# EAGLE design Wheel Speed Sensor rev 1 (EAGLE 9.5.0)
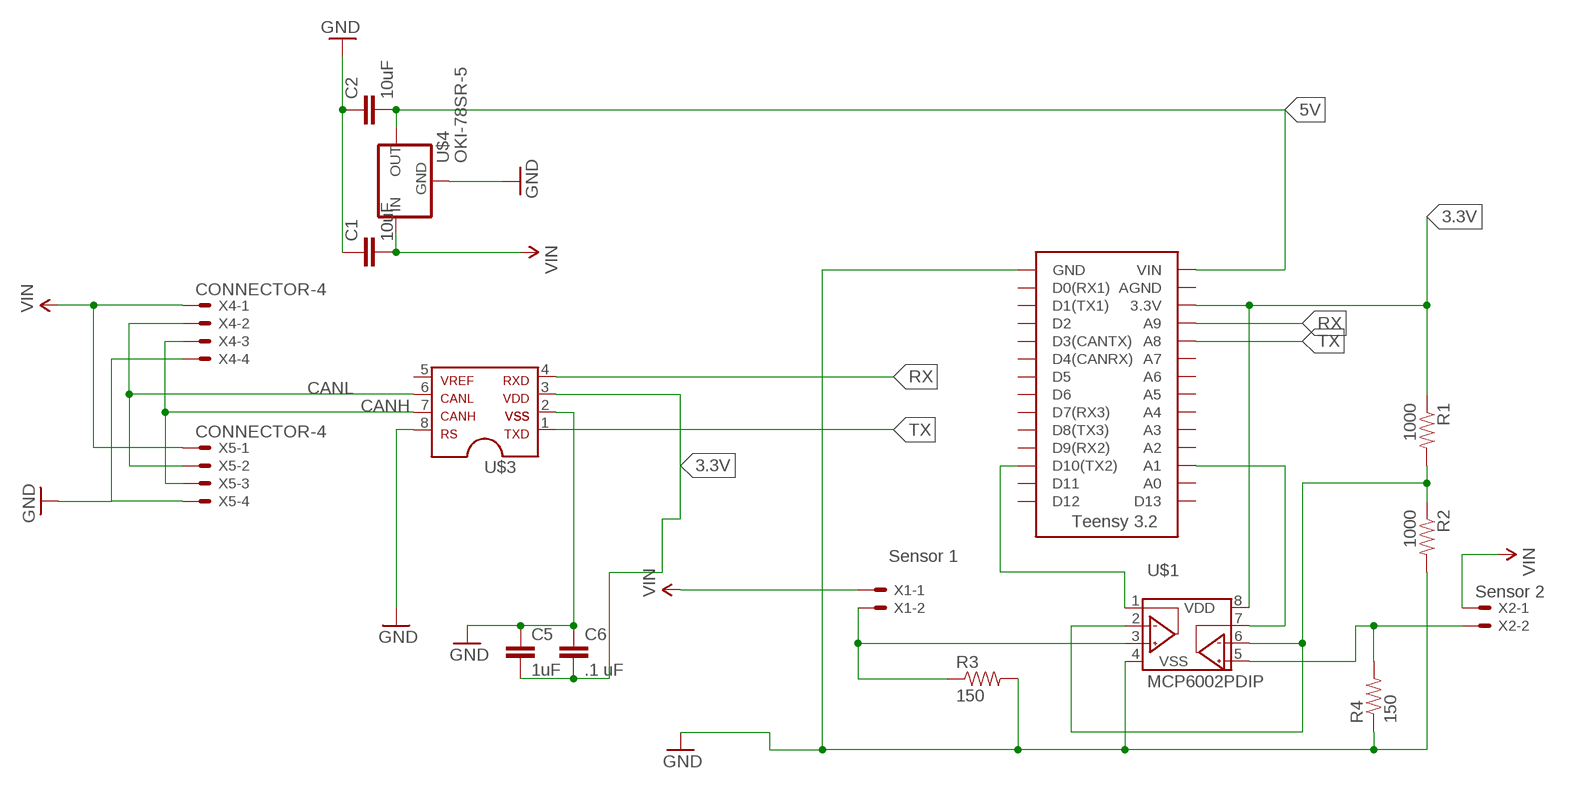
[diagram p0: schematic, sheet 1]

## Parts
C1  10uF  CAPPTH1  [CAP-PTH-5MM]
C2  10uF  CAPPTH1  [CAP-PTH-5MM]
C5  1uF  CAPPTH1  [CAP-PTH-5MM]
C6  .1 uF  CAPPTH1  [CAP-PTH-5MM]
R1  1000  RESISTORAXIAL-0.3  [AXIAL-0.3]
R2  1000  RESISTORAXIAL-0.3  [AXIAL-0.3]
R3  150  RESISTORAXIAL-0.3  [AXIAL-0.3]
R4  150  RESISTORAXIAL-0.3  [AXIAL-0.3]
U$1  MCP6002PDIP  [DIL08]
U$2  TEENSY_3.2_SIMPLE  [TEENSY_3.2_SIMPLE]
U$3  MCP2551  [SOIC-08]
U$4  OKI-78SR-5  [OKI-78SR]
X1  Sensor 1  CONNECTOR-2  [MINIFIT_5566-2]
X2  Sensor 2  CONNECTOR-2  [MINIFIT_5566-2]
X4  CONNECTOR-4  [MINIFIT_5566-4]
X5  CONNECTOR-4  [MINIFIT_5566-4]

## Nets
3.3V: C5.2 C6.2 R1.P$1 U$1.8(VDD) U$2.3.3V U$3.3
5V: C2.2 U$2.VIN U$4.3(OUT)
CANH: U$3.7 X4.3 X5.3
CANL: U$3.6 X4.2 X5.2
GND: C1.1 C2.1 C5.1 C6.1 R2.P$2 R3.P$2 R4.P$1 U$1.4(VSS) U$2.GND U$3.2 U$3.8 U$4.2(GND) X4.4 X5.4
N$2: R1.P$2 R2.P$1 U$1.2(VINA-) U$1.6(VINB-)
N$4: R3.P$1 U$1.3(VINA+) X1.2
N$5: U$1.7(VOUTB) U$2.A1
N$6: U$1.1(VOUTA) U$2.D10(TX2)
N$8: R4.P$2 U$1.5(VINB+) X2.2
RX: U$2.A9 U$3.4
TX: U$2.A8 U$3.1
VIN: C1.2 U$4.1(IN) X1.1 X2.1 X4.1 X5.1
Unconnected: U$2.A0 U$2.A2 U$2.A3 U$2.A4 U$2.A5 U$2.A6 U$2.A7 U$2.AGND U$2.D0(RX1) U$2.D1(TX1) U$2.D2 U$2.D3(CANTX) U$2.D4(CANRX) U$2.D5 U$2.D6 U$2.D7(RX3) U$2.D8(TX3) U$2.D9(RX2) U$2.D11 U$2.D12 U$2.D13 U$3.5

## Library data of the parts
C1 C2 C5 C6 = HyTechDevices:CAP: Capacitor Standard 0603 ceramic capacitor, and 0.1" leaded capacitor.
R1-R4 = HyTechDevices:RESISTOR: Resistor Basic schematic elements and footprints for 0603, 1206, and PTH resistors.
U$1 = HyTechDevices:MCP6002: Microchip MCP6002 Dual Channel Op Amp
U$2 = HyTechDevices:TEENSY_3.2_SIMPLE: Simple version of the Teensy 3.2 board that only uses the 2 main rows of pins, not the inner pins or the pins opposite the usb port.
U$3 = HyTechDevices:MCP2551: MCP2551 High-Speed CAN Transceiver Product Webpage <https://www.microchip.com/wwwproducts/en/MCP2551> Datasheet <http://ww1.microchip.com/downloads/en/DeviceDoc/21667f.pdf> This device is outdated It is replaced by MCP2561. Comparison Page <https://www.microchip.com/wwwproducts/ProductCompare/MCP2551/MCP2561> Product Webpage <https://www.microchip.com/wwwproducts/en/MCP2561> Datasheet <http://ww1.microchip.com/downloads/en/DeviceDoc/20005167C.pdf>
U$4 = HyTechDevices:OKI-78SR-5: Murata OKI-78SR 5V 1.5A Non-Isolated Switching Regulator DC/DC - Datasheet <https://power.murata.com/data/power/oki-78sr.pdf>
X1 X2 = HyTechDevices:CONNECTOR-2: Mini-Fit Junior connector 2 pole Source: http://www.molex.com; OC_FARNELL: 1822072; OC_NEWARK: unknown
X4 X5 = HyTechDevices:CONNECTOR-4: Mini-Fit Junior connector 4 pole Source: http://www.molex.com; OC_FARNELL: unknown; OC_NEWARK: unknown

## Board
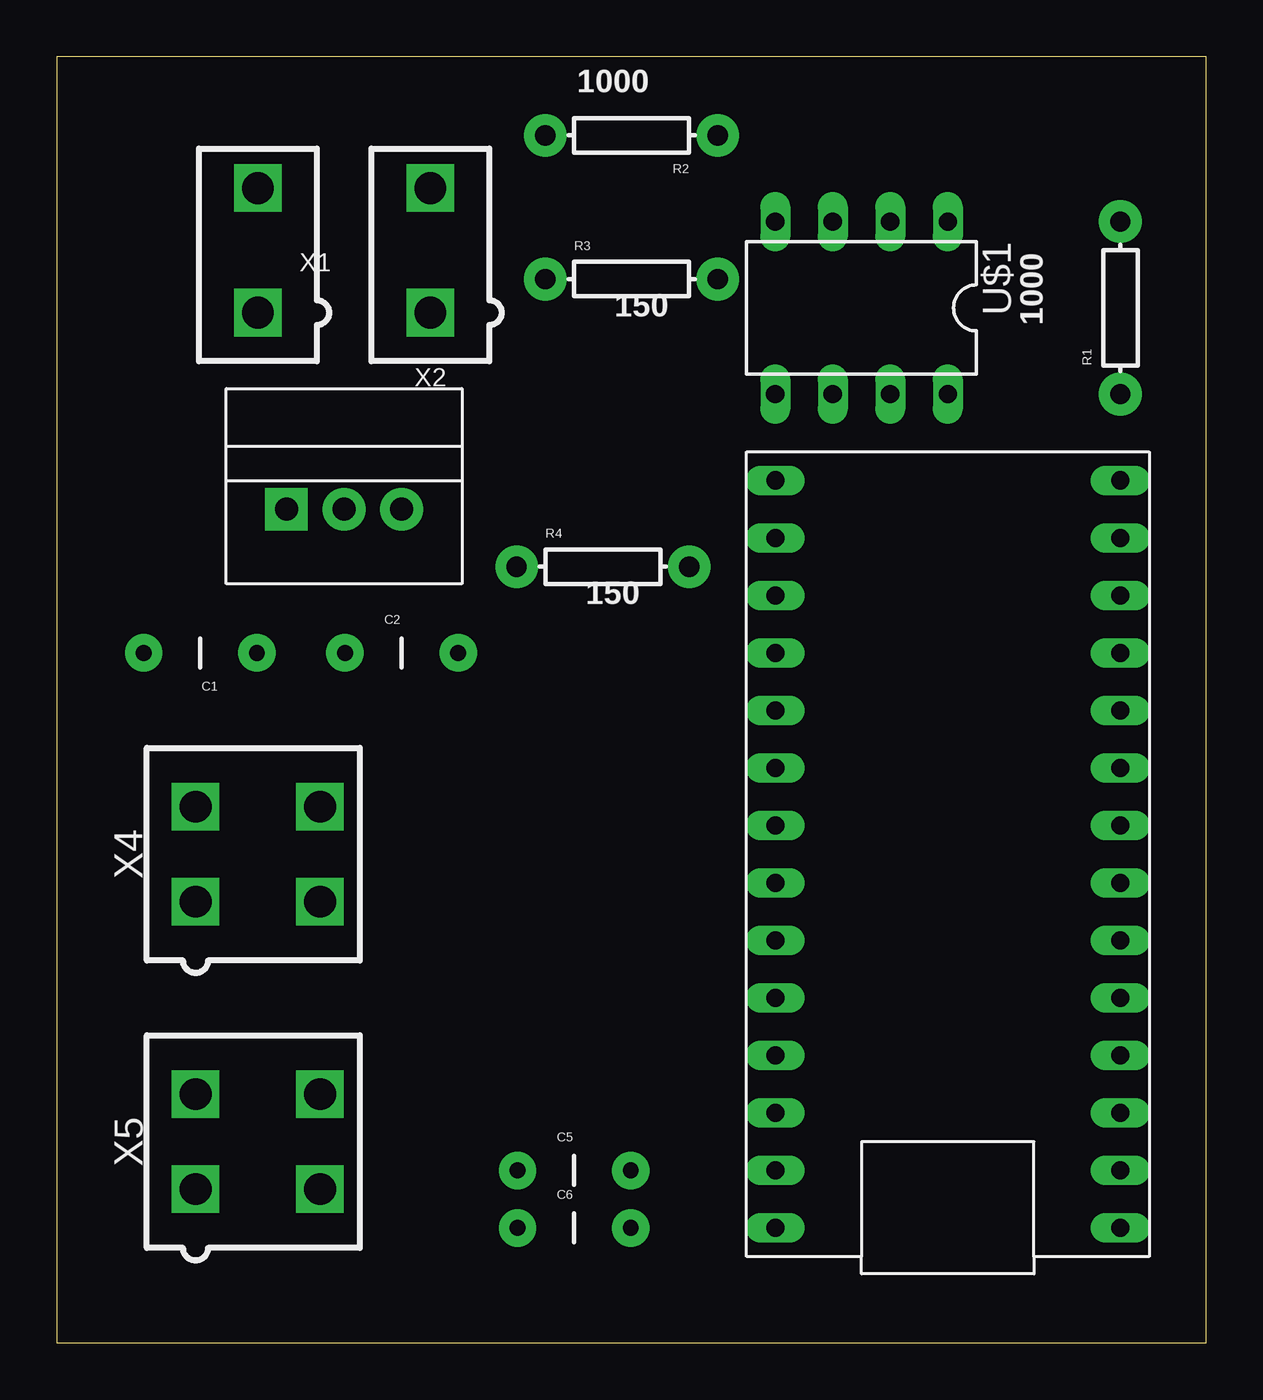
[diagram p1: board, top side]
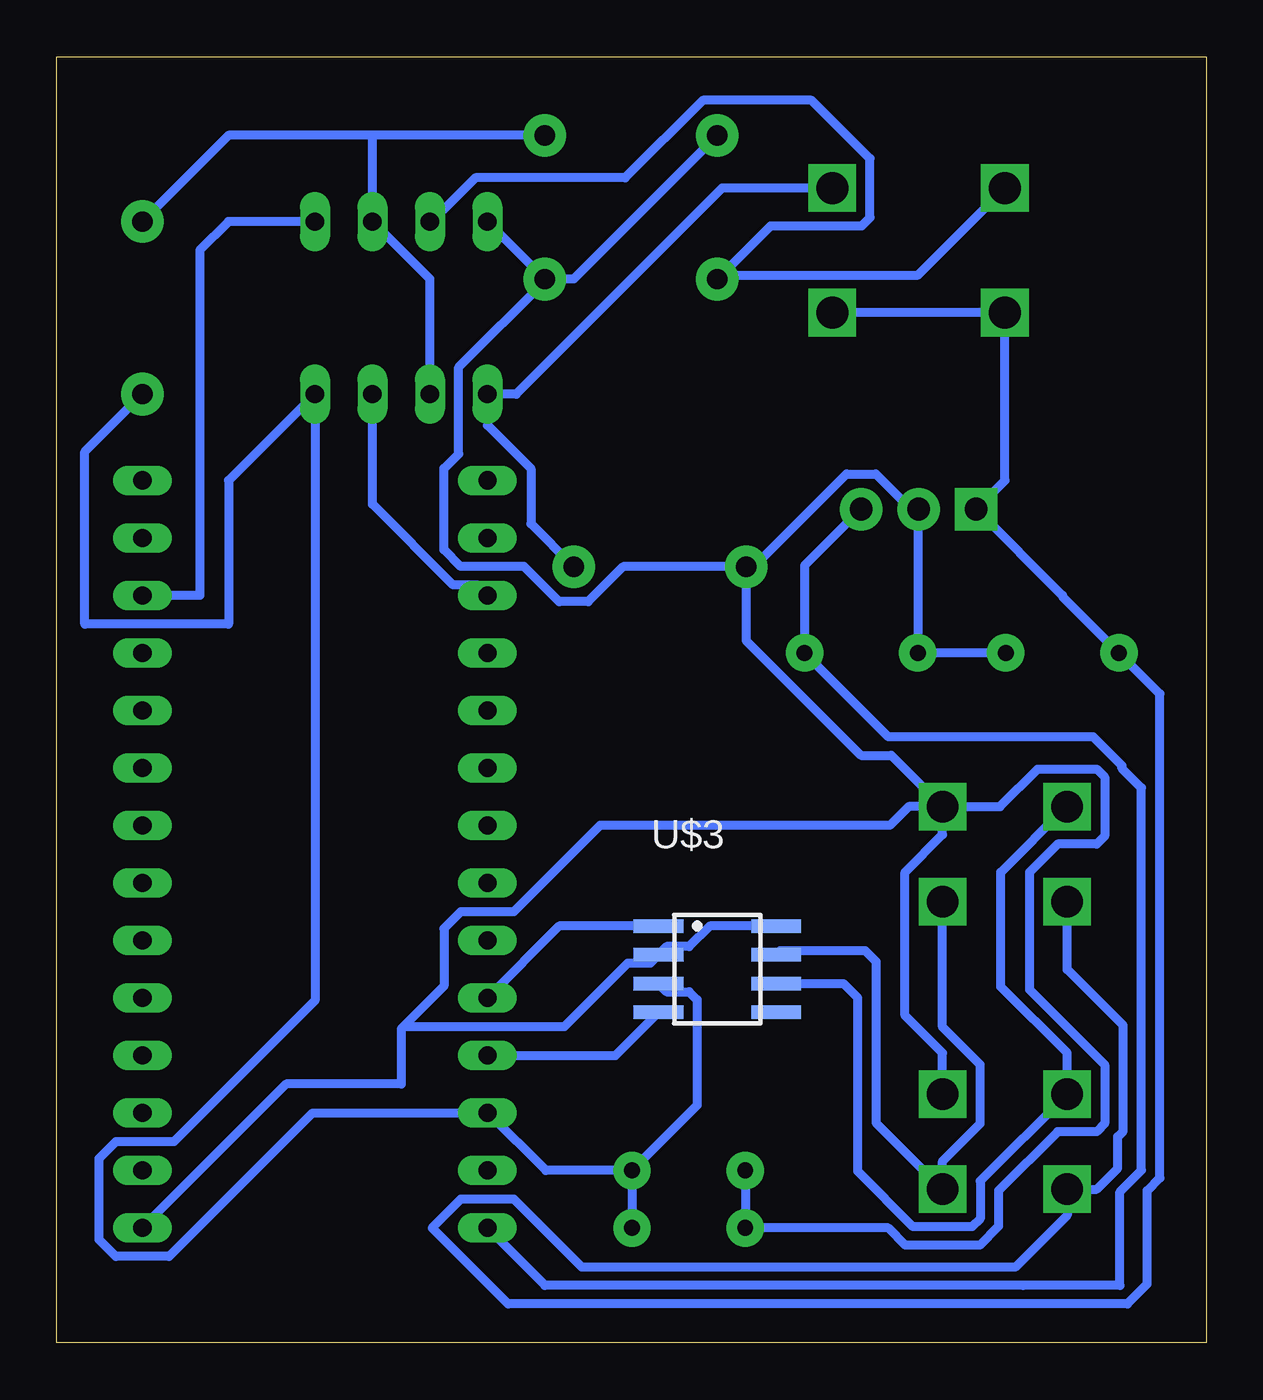
[diagram p2: board, bottom side, seen from below]

Size 50.78 x 56.82 mm. Coordinates in mm from the lower left corner, seen from the top.
Outline: 0,0 50.78,0 50.78,56.82 0,56.82 0,0
Copper layers (1*16): Top 0.035mm / dielectric 1.5mm / Bottom 0.035mm
Design rules "default *": minimum track width 16mil, minimum drill 0.35mm, track to track 16mil, track to pad 16mil, pad to pad 16mil, via to via 16mil, smd to smd 16mil, copper to edge 40mil, drill to drill 6mil, minimum pad ring 10mil, minimum via ring 8mil, stop-mask expansion 4mil, vias tented up to drill 0mil, thermal gap 10mil

### Footprints (pad centres in the part's own frame; a part is rotated, then mirrored left to right if it is on the bottom)
CAP-PTH-5MM = drill 0.7 pad 1.651: 1 -2.5,0; 2 2.5,0
AXIAL-0.3 = drill 0.9 pad 1.88: P$1 -3.81,0; P$2 3.81,0
DIL08 = drill 0.813 long: 1 -3.81,-3.81; 2 -1.27,-3.81; 3 1.27,-3.81; 4 3.81,-3.81; 5 3.81,3.81; 6 1.27,3.81; 7 -1.27,3.81; 8 -3.81,3.81
TEENSY_3.2_SIMPLE = drill 0.8 long: 3.3V 16.51,29.21; A0 16.51,3.81; A1 16.51,6.35; A2 16.51,8.89; A3 16.51,11.43; A4 16.51,13.97; A5 16.51,16.51; A6 16.51,19.05; A7 16.51,21.59; A8 16.51,24.13; A9 16.51,26.67; AGND 16.51,31.75; D0(RX1) 1.27,31.75; D1(TX1) 1.27,29.21; D2 1.27,26.67; D3(CANTX) 1.27,24.13; D4(CANRX) 1.27,21.59; D5 1.27,19.05; D6 1.27,16.51; D7(RX3) 1.27,13.97; D8(TX3) 1.27,11.43; D9(RX2) 1.27,8.89; D10(TX2) 1.27,6.35; D11 1.27,3.81; D12 1.27,1.27; D13 16.51,1.27; GND 1.27,34.29; VIN 16.51,34.29
SOIC-08 = smd 0.6 x 2.2: 1 -1.905,-2.6; 2 -0.635,-2.6; 3 0.635,-2.6; 4 1.905,-2.6; 5 1.905,2.6; 6 0.635,2.6; 7 -0.635,2.6; 8 -1.905,2.6
OKI-78SR = drill 1 pad 1.88 square: 1 -2.54,0 | drill 1 pad 1.88: 2 0,0; 3 2.54,0
MINIFIT_5566-2 = drill 1.4 square: 1 0,-2.75; 2 0,2.75
MINIFIT_5566-4 = drill 1.4 square: 1 2.1,-2.75; 2 -2.1,-2.75; 3 2.1,2.75; 4 -2.1,2.75

### Placement (x,y rotation side)
C1  6.35,30.48 180 top
C2  15.24,30.48 0 top
C5  22.86,7.62 0 top
C6  22.86,5.08 0 top
R1  46.99,45.72 90 top
R2  25.4,53.34 180 top
R3  25.4,46.99 0 top
R4  24.13,34.29 0 top
U$1  35.56,45.72 180 top
U$2  48.26,39.37 180 top
U$3  21.59,16.51 270 bottom
U$4  12.7,36.83 0 top
X1  8.89,48.26 0 top
X2  16.51,48.26 0 top
X4  8.89,21.59 270 top
X5  8.89,8.89 270 top

### Tracks (layer width: path | path; a pad name or v marks a point on that pad's centre or on a via)
3.3V
  Bottom 0.406: R1.P$1 49.53,39.37 49.53,31.75 43.18,31.75 43.18,38.1 U$1.8 39.37,15.12 45.61,8.88 48.17,8.88 48.91,8.14 48.91,4.56 48.17,3.82 45.81,3.82 39.47,10.16 U$2.3.3V 31.71,10.16 29.17,7.62 C5.2 | C5.2 C6.2 | U$3.3 23.83,15.52 22.84,15.52 22.48,15.16 22.48,10.5 C5.2
5V
  Bottom 0.406: U$4.3 17.74,34.33 C2.2 14.03,26.77 4.98,26.77 3.71,25.5 3.71,25.38 2.86,24.52 2.86,7.62 3.81,6.67 3.81,2.54 8.09,2.54 29.21,2.54 U$2.VIN
CANH
  Bottom 0.406: X4.3 11.64,13.95 9.98,12.29 9.98,9.69 11.64,8.03 X5.3 14.58,9.73 14.58,16.85 15.06,17.32 18.81,17.32 U$3.7
CANL
  Bottom 0.406: X4.2 6.17,23.69 9.07,20.79 9.07,15.73 6.14,12.8 X5.2 9.98,7.15 9.98,5.49 10.34,5.13 12.94,5.13 15.39,7.58 15.39,15.24 16.03,15.88 U$3.6
GND
  Bottom 0.406: R4.P$1 19.97,34.29 15.88,38.38 14.6,38.38 13.05,36.83 U$4.2 12.74,36.79 C2.1 C1.1 | R2.P$2 27.94,46.99 R3.P$2 | R3.P$2 29.21,46.91 33.02,43.1 33.02,39.27 33.67,38.62 33.67,35.04 32.93,34.3 30.14,34.3 28.58,32.74 27.3,32.74 25.75,34.29 R4.P$1 | U$1.4 R3.P$2 | U$2.GND 40.63,11.44 35.56,11.44 35.56,13.87 35.45,13.98 | X5.4 11.64,12.8 13.3,14.46 13.3,20.79 11.64,22.45 X4.4 | C5.1 C6.1 14.04,5.08 13.28,4.32 10,4.32 9.17,5.15 9.17,6.73 6.56,9.33 4.84,9.33 4.48,9.69 4.48,12.29 7.8,15.61 7.8,20.79 6.56,22.03 4.84,22.03 4.48,22.39 4.48,24.99 4.84,25.35 7.44,25.35 9.1,23.69 X4.4 | 35.45,13.98 33.67,15.76 33.67,18.3 32.93,19.04 30.59,19.04 26.77,22.86 13.97,22.86 13.14,23.69 X4.4 | 35.45,13.98 28.35,13.98 25.54,16.79 24.55,16.79 U$3.2 23.83,17.51 22.84,17.51 21.93,18.41 U$3.8 | X4.4 13.9,25.95 15.24,25.95 20.32,31.03 R4.P$1
N$2
  Bottom 0.406: R2.P$1 36.83,53.34 | 36.83,53.34 43.18,53.34 R1.P$2 | 36.83,53.34 U$1.2 34.29,46.99 U$1.6
N$4
  Bottom 0.406: 21.41,47.17 12.73,47.17 X1.2 | U$1.3 34.21,49.53 32.28,51.46 25.66,51.46 22.23,54.89 17.43,54.89 14.85,52.31 14.85,49.71 15.21,49.35 19.23,49.35 21.41,47.17 | R3.P$1 21.41,47.17
N$5
  Bottom 0.406: U$2.A1 32.21,33.48 33.26,33.48 36.83,37.05 U$1.7
N$6
  Bottom 0.406: U$1.1 43.18,49.53 44.45,48.26 44.45,33.02 U$2.D10(TX2)
N$8
  Bottom 0.406: R4.P$2 29.83,36.18 29.83,38.62 31.75,40.54 U$1.5 30.48,41.91 21.38,51.01 X2.2
RX
  Bottom 0.406: U$2.A9 26.09,12.7 U$3.4
TX
  Bottom 0.406: U$3.1 28.57,18.41 U$2.A8
VIN
  Bottom 0.406: X2.1 X1.1 8.89,38.1 U$4.1 6.35,33.02 6.35,32.98 C1.2 2.04,28.67 2.04,7.29 2.6,6.73 2.6,2.6 3.48,1.72 30.84,1.72 34.19,5.08 32.93,6.34 30.57,6.34 27.58,3.35 8.43,3.35 6.14,5.64 X5.1 4.84,6.79 3.91,7.72 3.91,9.11 3.67,9.35 3.67,14.02 6.14,16.49 X4.1